# EasyEDA schematic 1-Schematic_Expansion_Card.json
TITLE: Google Coral Framework; REV: 1.0; Date: 2022-05-15; Sheet: 1/1; Drawn By: Gena Jok; Company: Your Company
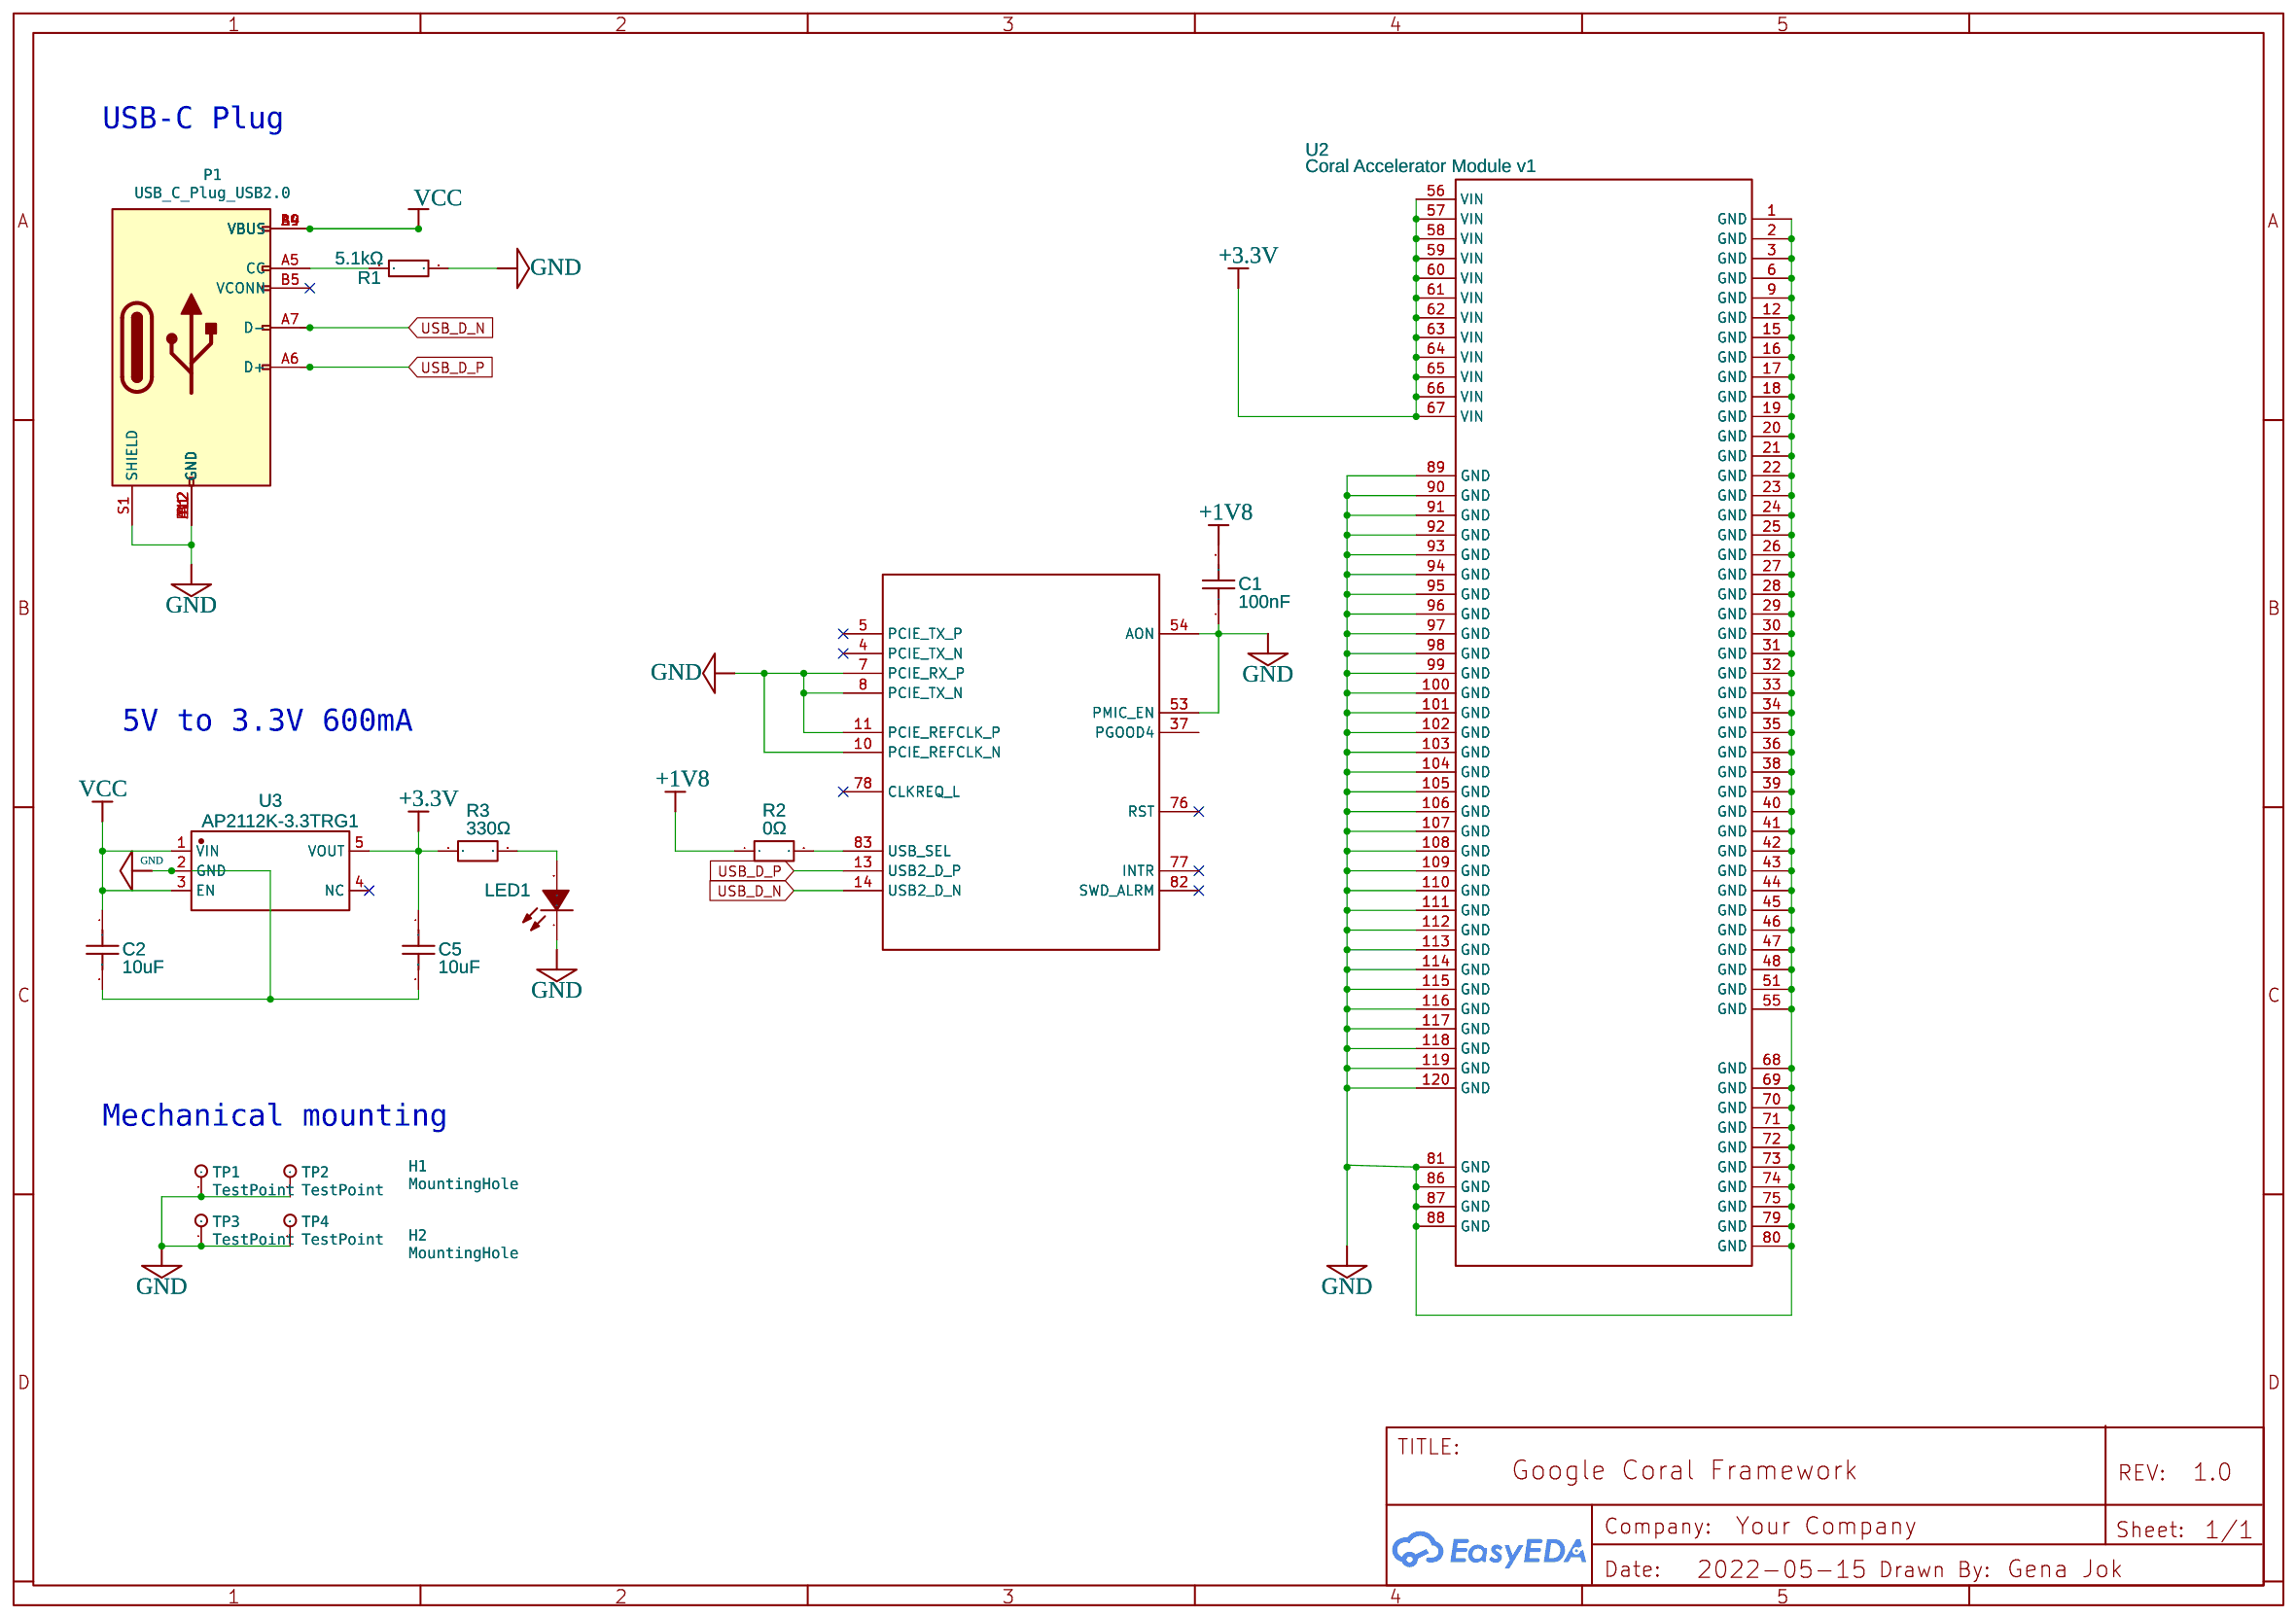
[diagram p0: schematic sheet]

## Parts
C1  100nF  [C0805]
C2  10uF  [C0805]
C5  10uF  [C0805]
H1  MountingHole  [MOUNTINGHOLE_2.2MM_M2]
H2  MountingHole  [MOUNTINGHOLE_2.2MM_M2]
LED1  99-213/G6C-BQ1R2B/2C  [LED-SMD_L2.8-W1.2-RD]
P1  USB_C_Plug_USB2.0  [USB_C_PLUG_MOLEX_105444]
R1  5.1kΩ  [R0603]
R2  0Ω  [R2512]
R3  330Ω  [R0603]
TP1  TestPoint  [TESTPOINT_PAD_1.5X1.5MM]
TP2  TestPoint  [TESTPOINT_PAD_1.5X1.5MM]
TP3  TestPoint  [TESTPOINT_PAD_1.5X1.5MM]
TP4  TestPoint  [TESTPOINT_PAD_1.5X1.5MM]
U2  Coral Accelerator Module v1  [CORAL ACCELERATOR MODULE V1]
U3  AP2112K-3.3TRG1  [SOT-25-5_L3.0-W1.8-P0.95-LS3.0-BR]

## Library data of the parts
C1 = CT41G-0805-2X1-50V-0.1UF-K(N): Supplier: LCSC; Supplier Part: C126469; Manufacturer: TORCH; Manufacturer Part: CT41G-0805-2X1-50V-0.1uF-K(N); Contributor: LCSC; JLCPCB Part Class: Extended Part
C2 C5 = 0805B106K100NT: Supplier: LCSC; Manufacturer: FH; Supplier Part: C90544; JLCPCB Part Class: Extended Part
LED1 = 99-213/G6C-BQ1R2B/2C: Supplier: LCSC; Supplier Part: C264617; Manufacturer: Everlight Elec; Contributor: LCSC
P1 = -: Datasheet: https://www.usb.org/sites/default/files/documents/usb_type-c.zip
R1 = RMC06035.1K1%N: Supplier: LCSC; Supplier Part: C269716; Manufacturer: Tyohm; Resistance (Ohms): 5.1K; Contributor: LCSC; JLCPCB Part Class: Extended Part
R2 = HOT2512D-3W-0R: Supplier: LCSC; Supplier Part: C556651; Manufacturer: Milliohm; Manufacturer Part: HoT2512D-3W-0R; Contributor: LCSC; JLCPCB Part Class: Extended Part
R3 = RT0603DRD07330RL: Supplier: LCSC; Supplier Part: C723588; Manufacturer: YAGEO; Contributor: LCSC; JLCPCB Part Class: Extended Part
U2 = Coral Accelerator Module v1: Contributor: driftdevelopers.iot
U3 = AP2112K-3.3TRG1: Supplier: LCSC; Manufacturer: DIODES; Contributor: LCSC; Supplier Part: C51118; JLCPCB Part Class: Extended Part

## Nets
+1V8: C1.2 R2.1
+3.3V: C5.1 R3.1 U2.56(VIN) U2.57(VIN) U2.58(VIN) U2.59(VIN) U2.60(VIN) U2.61(VIN) U2.62(VIN) U2.63(VIN) U2.64(VIN) U2.65(VIN) U2.66(VIN) U2.67(VIN) U3.5(VOUT)
GND: C1.1 C2.2 C5.2 LED1.1(K) P1.A1(GND) P1.A12(GND) P1.B1(GND) P1.B12(GND) P1.S1(SHIELD) R1.2 TP1.1 TP2.1 TP3.1 TP4.1 U2.1(GND) U2.2(GND) U2.3(GND) U2.6(GND) U2.7(PCIE_RX_P) U2.8(PCIE_TX_N) U2.9(GND) U2.10(PCIE_REFCLK_N) U2.11(PCIE_REFCLK_P) U2.12(GND) U2.15(GND) U2.16(GND) U2.17(GND) U2.18(GND) U2.19(GND) U2.20(GND) U2.21(GND) U2.22(GND) U2.23(GND) U2.24(GND) U2.25(GND) U2.26(GND) U2.27(GND) U2.28(GND) U2.29(GND) U2.30(GND) U2.31(GND) U2.32(GND) U2.33(GND) U2.34(GND) U2.35(GND) U2.36(GND) U2.38(GND) U2.39(GND) U2.40(GND) U2.41(GND) U2.42(GND) U2.43(GND) U2.44(GND) U2.45(GND) U2.46(GND) U2.47(GND) U2.48(GND) U2.51(GND) U2.53(PMIC_EN) U2.54(AON) U2.55(GND) U2.68(GND) U2.69(GND) U2.70(GND) U2.71(GND) U2.72(GND) U2.73(GND) U2.74(GND) U2.75(GND) U2.79(GND) U2.80(GND) U2.81(GND) U2.86(GND) U2.87(GND) U2.88(GND) U2.89(GND) U2.90(GND) U2.91(GND) U2.92(GND) U2.93(GND) U2.94(GND) U2.95(GND) U2.96(GND) U2.97(GND) U2.98(GND) U2.99(GND) U2.100(GND) U2.101(GND) U2.102(GND) U2.103(GND) U2.104(GND) U2.105(GND) U2.106(GND) U2.107(GND) U2.108(GND) U2.109(GND) U2.110(GND) U2.111(GND) U2.112(GND) U2.113(GND) U2.114(GND) U2.115(GND) U2.116(GND) U2.117(GND) U2.118(GND) U2.119(GND) U2.120(GND) U3.2(GND)
VCC: C2.1 P1.A4(VBUS) P1.A9(VBUS) P1.B4(VBUS) P1.B9(VBUS) U3.1(VIN) U3.3(EN)
USB_D_N: P1.A7(D-) U2.14(USB2_D_N)
USB_D_P: P1.A6(D+) U2.13(USB2_D_P)
Net-(LED1-2): LED1.2(A) R3.2
Net-(P1-A5): P1.A5(CC) R1.1
Net-(R2-2): R2.2 U2.83(USB_SEL)

Not connected (* = marked no-connect by the designer): P1 B5(VCONN)*; U2 4(PCIE_TX_N)* 5(PCIE_TX_P)* 37(PGOOD4) 76(RST)* 77(INTR)* 78(CLKREQ_L)* 82(SWD_ALRM)*; U3 4(NC)*

## Notes on the sheet
- USB-C Plug
- 5V to 3.3V 600mA
- Mechanical mounting
